# Altium project SolarNode.PrjPCB
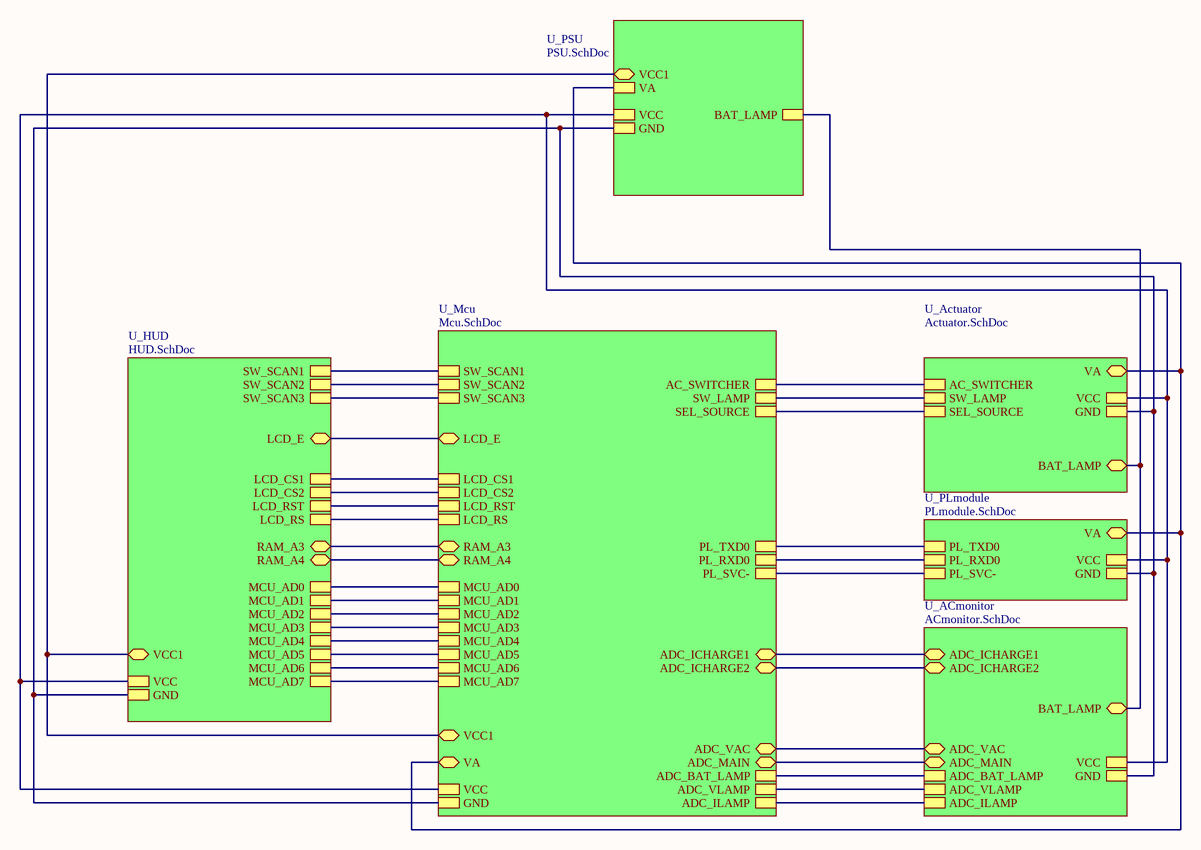
[diagram p0: block.SchDoc]
5 sheets, 176 parts. Net scope: hierarchical (ports join the sheet entries above them; power ports are global).
Board file: SolarNode.PcbDoc
Sheets:
  block.SchDoc
    U_Actuator = Actuator.SchDoc
    U_PSU = PSU.SchDoc
    U_PLmodule = PLmodule.SchDoc
    U_ACmonitor = ACmonitor.SchDoc

## Sheet block.SchDoc
size Letter

### Sub-sheets
U_ACmonitor = ACmonitor.SchDoc: ADC_BAT_LAMP, ADC_VLAMP, ADC_ILAMP, VCC, GND, ADC_VAC, BAT_LAMP, ADC_MAIN, ADC_ICHARGE1, ADC_ICHARGE2
U_Actuator = Actuator.SchDoc: AC_SWITCHER, SW_LAMP, SEL_SOURCE, VCC, GND, BAT_LAMP, VA
U_HUD = HUD.SchDoc (file not in this document): MCU_AD0, MCU_AD1, MCU_AD2, MCU_AD3, MCU_AD4, MCU_AD5, MCU_AD6, MCU_AD7, LCD_CS1, LCD_CS2, LCD_RST, LCD_RS, SW_SCAN1, SW_SCAN2, SW_SCAN3, VCC, GND, LCD_E, RAM_A3, RAM_A4, VCC1
U_Mcu = Mcu.SchDoc (file not in this document): PL_TXD0, PL_RXD0, SW_SCAN1, SW_SCAN2, SW_SCAN3, PL_SVC-, LCD_CS1, LCD_CS2, LCD_RST, LCD_RS, AC_SWITCHER, SW_LAMP, SEL_SOURCE, MCU_AD0, MCU_AD1, MCU_AD2, MCU_AD3, MCU_AD4, MCU_AD5, MCU_AD6, MCU_AD7, VCC, GND, ADC_BAT_LAMP, ADC_VLAMP, ADC_ILAMP, ADC_VAC, LCD_E, ADC_MAIN, VA, ADC_ICHARGE1, ADC_ICHARGE2, RAM_A3, RAM_A4, VCC1
U_PLmodule = PLmodule.SchDoc: PL_SVC-, VCC, GND, PL_TXD0, PL_RXD0, VA
U_PSU = PSU.SchDoc: VCC, GND, BAT_LAMP, VA, VCC1

### Nets
BAT_LAMP: sheet U_Actuator/BAT_LAMP, sheet U_PSU/BAT_LAMP, sheet U_ACmonitor/BAT_LAMP
GND: sheet U_Mcu/GND, sheet U_Actuator/GND, sheet U_PSU/GND, sheet U_HUD/GND, sheet U_PLmodule/GND, sheet U_ACmonitor/GND
VA: sheet U_Mcu/VA, sheet U_Actuator/VA, sheet U_PSU/VA, sheet U_PLmodule/VA
VCC: sheet U_Mcu/VCC, sheet U_Actuator/VCC, sheet U_PSU/VCC, sheet U_HUD/VCC, sheet U_PLmodule/VCC, sheet U_ACmonitor/VCC
VCC1: sheet U_Mcu/VCC1, sheet U_PSU/VCC1, sheet U_HUD/VCC1
AC SWITCHER: sheet U_Mcu/AC_SWITCHER, sheet U_Actuator/AC_SWITCHER
ADC_BAT_LAMP: sheet U_Mcu/ADC_BAT_LAMP, sheet U_ACmonitor/ADC_BAT_LAMP
ADC_ICHARGE1: sheet U_Mcu/ADC_ICHARGE1, sheet U_ACmonitor/ADC_ICHARGE1
ADC_ICHARGE2: sheet U_Mcu/ADC_ICHARGE2, sheet U_ACmonitor/ADC_ICHARGE2
ADC_ILAMP: sheet U_Mcu/ADC_ILAMP, sheet U_ACmonitor/ADC_ILAMP
ADC_MAIN: sheet U_Mcu/ADC_MAIN, sheet U_ACmonitor/ADC_MAIN
ADC_VAC: sheet U_Mcu/ADC_VAC, sheet U_ACmonitor/ADC_VAC
ADC_VLAMP: sheet U_Mcu/ADC_VLAMP, sheet U_ACmonitor/ADC_VLAMP
IO_8: sheet U_Mcu/PL_TXD0, sheet U_PLmodule/PL_TXD0
IO_10: sheet U_Mcu/PL_RXD0, sheet U_PLmodule/PL_RXD0
PL_SVC-: sheet U_Mcu/PL_SVC-, sheet U_PLmodule/PL_SVC-
SEL_SOURCE: sheet U_Mcu/SEL_SOURCE, sheet U_Actuator/SEL_SOURCE
SW_LAMP: sheet U_Mcu/SW_LAMP, sheet U_Actuator/SW_LAMP
(unnamed): sheet U_Mcu/SW_SCAN1, sheet U_HUD/SW_SCAN1
(unnamed): sheet U_Mcu/SW_SCAN2, sheet U_HUD/SW_SCAN2
(unnamed): sheet U_Mcu/SW_SCAN3, sheet U_HUD/SW_SCAN3
(unnamed): sheet U_Mcu/LCD_CS1, sheet U_HUD/LCD_CS1
(unnamed): sheet U_Mcu/LCD_CS2, sheet U_HUD/LCD_CS2
(unnamed): sheet U_Mcu/LCD_RST, sheet U_HUD/LCD_RST
(unnamed): sheet U_Mcu/LCD_RS, sheet U_HUD/LCD_RS
(unnamed): sheet U_Mcu/MCU_AD0, sheet U_HUD/MCU_AD0
(unnamed): sheet U_Mcu/MCU_AD1, sheet U_HUD/MCU_AD1
(unnamed): sheet U_Mcu/MCU_AD2, sheet U_HUD/MCU_AD2
(unnamed): sheet U_Mcu/MCU_AD3, sheet U_HUD/MCU_AD3
(unnamed): sheet U_Mcu/MCU_AD4, sheet U_HUD/MCU_AD4
(unnamed): sheet U_Mcu/MCU_AD5, sheet U_HUD/MCU_AD5
(unnamed): sheet U_Mcu/MCU_AD6, sheet U_HUD/MCU_AD6
(unnamed): sheet U_Mcu/MCU_AD7, sheet U_HUD/MCU_AD7
(unnamed): sheet U_Mcu/LCD_E, sheet U_HUD/LCD_E
(unnamed): sheet U_Mcu/RAM_A3, sheet U_HUD/RAM_A3
(unnamed): sheet U_Mcu/RAM_A4, sheet U_HUD/RAM_A4

## Sheet Actuator.SchDoc
size A3
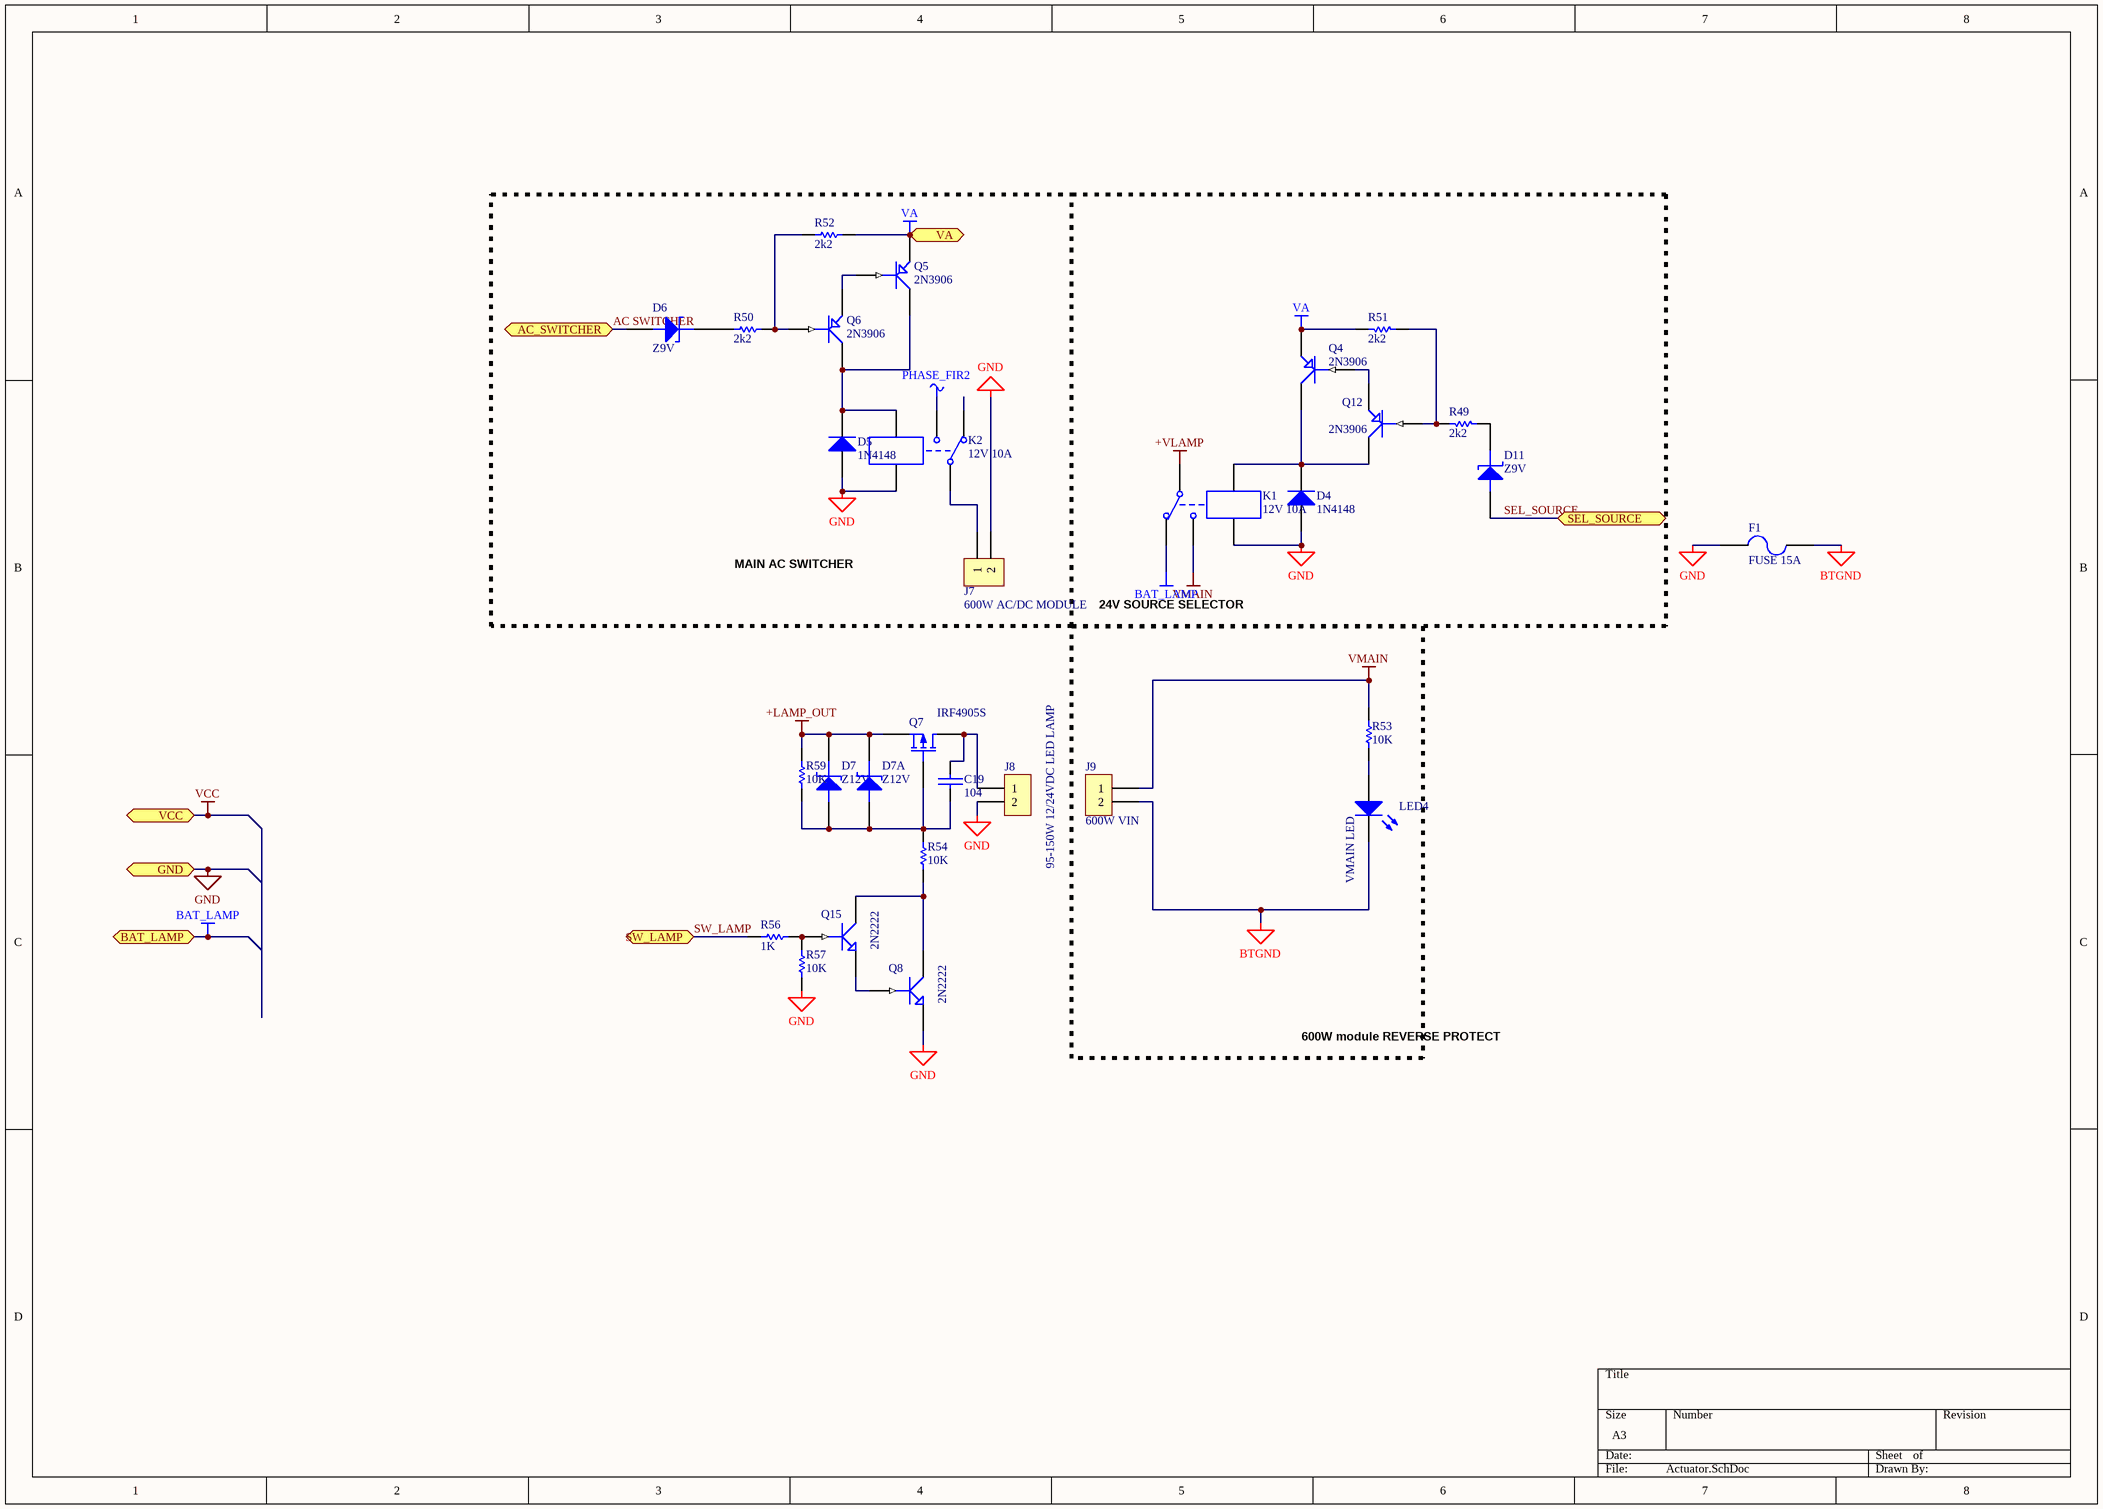
[diagram p1: Actuator.SchDoc]

### Parts
C19  104  [C6-0805_N]
D4  1N4148  [SOD80, LL-34]
D5  1N4148  [SOD80, LL-34]
D6  Z9V  [SOD80, LL-34]
D7  Z12V  [DO-35]
D7A  Z12V  [SOD80, LL-34]
D11  Z9V  [SOD80, LL-34]
F1  FUSE 15A  [FUSE2]
J7  600W AC/DC MODULE  [TERMINAL2]
J8  95-150W 12/24VDC LED LAMP  [TERMINAL2]
J9  600W VIN  [TERMINAL2]
K1  12V 10A  [RELAYVUONG]
K2  12V 10A  [RELAYVUONG]
LED4  VMAIN LED  [led3mm]
Q4  2N3906  [SOT23-3]
Q5  2N3906  [SOT23-3]
Q6  2N3906  [SOT23-3]
Q7  IRF4905S  [D2PAK-3]
Q8  2N2222  [SOT23-3]
Q12  2N3906  [SOT23-3]
Q15  2N2222  [SOT23-3]
R49  2k2  [6-0805_N]
R50  2k2  [6-0805_N]
R51  2k2  [6-0805_N]
R52  2k2  [6-0805_N]
R53  10K  [6-0805_N]
R54  10K  [6-0805_N]
R56  1K  [6-0805_N]
R57  10K  [6-0805_N]
R59  10K  [6-0805_N]

### Blocks framed on the sheet
24V SOURCE SELECTOR: D4 D11 K1 Q4 Q12 R49 R51

### Ports
AC_SWITCHER, BAT_LAMP, GND, SEL_SOURCE, SW_LAMP, VA, VCC

### Nets
+LAMP_OUT: D7.2(K) D7A.2(K) Q7.3(S) R59.2
+VLAMP: K1.1
BAT_LAMP: K1.2 ; port BAT_LAMP
BTGND: F1.2 J9.2 LED4.2(K)
GND: D4.1(A) D5.1(A) F1.1 J7.2 J8.2 K1.5 K2.4 Q8.2(E) R57.1 ; port GND
PHASE_FIR2: K2.3
VA: Q4.2(E) Q5.2(E) R51.2 R52.2 ; port VA
VMAIN: J9.1 K1.3 R53.2
AC SWITCHER: D6.1(A) ; port AC_SWITCHER
SEL_SOURCE: D11.1(A) ; port SEL_SOURCE
SW_LAMP: R56.1 ; port SW_LAMP
NetC19_1: C19.1 J8.1 Q7.2(D)
NetC19_2: C19.2 D7.1(A) D7A.1(A) Q7.1(G) R54.2 R59.1
NetD4_2: D4.2(K) K1.4 Q4.3(C) Q12.3(C)
NetD5_2: D5.2(K) K2.5 Q5.3(C) Q6.3(C)
NetD6_2: D6.2(K) R50.1
NetD11_2: D11.2(K) R49.1
NetJ7_1: J7.1 K2.1
NetLED4_1: LED4.1(A) R53.1
NetQ4_1: Q4.1(B) Q12.2(E)
NetQ5_1: Q5.1(B) Q6.2(E)
NetQ6_1: Q6.1(B) R50.2 R52.1
NetQ8_1: Q8.1(B) Q15.2(E)
NetQ8_3: Q8.3(C) Q15.3(C) R54.1
NetQ12_1: Q12.1(B) R49.2 R51.1
NetQ15_1: Q15.1(B) R56.2 R57.2

Not connected (* = marked no-connect by the designer): K2 2

### Notes on the sheet
- MAIN AC SWITCHER
- 600W module REVERSE PROTECT

### Library data of the parts
C19 = CAP: Capacitor
D4 D5 = Diode 1N4007: 1 Amp General Purpose Rectifier; pin to pad: 1>A 2>K; Published: 8-Jun-2000; LatestRevisionDate: 17-Jul-2002; LatestRevisionNote: Re-released for DXP Platform.; DatasheetDocument: 1998; PackageDocument: Aug-1999; PackageReference: DO-41; Publisher: Altium Limited; Code_JEDEC: DO-204-AL; ComponentLink1Description: Manufacturer Link; ComponentLink1URL: http://www.fairchildsemi.com/; ComponentLink2Description: Datasheet; ComponentLink2URL: http://www.fairchildsemi.com/ds/1N%2F1N4001.pdf
D6 D7A D11 = ZENER2: Zener Diode; pin to pad: 1>A 2>K
D7 = ZENER2: Zener Diode
F1 = FUSE2: Fuse
J7-J9 = CON2: Connector
K1 K2 = Relay-SPDT: G5LA-10A/250VAC / SRC-12VDC-SL-C; Published: 24-Mar-1999; LatestRevisionDate: 17-Jul-2002; LatestRevisionNote: Re-released for DXP Platform.; PackageReference: MODULE5B; Publisher: Altium Limited
LED4 = LED3: Typical BLUE SiC LED; Published: 8-Jun-2000; LatestRevisionDate: 17-Dec-2003; LatestRevisionNote: PCB Footprint replaced.; DatasheetVersion: 16-Apr-2002; PackageVersion: 16-Apr-2002; PackageReference: 3.5X2.8X1.9; Publisher: Altium Limited; PackageDescription: SM LED; 2 C-Bend Leads; Body 3.5 x 2.8 x 1.9 mm, inc leads (LxWxH typ)
Q4-Q6 Q12 = PNP1: PNP Transistor
Q7 = MOSFET-P: HEXFET Power P MOSFET; pin to pad: 2>4; Published: 8-Jun-2000; LatestRevisionDate: 17-Jul-2002; LatestRevisionNote: Re-released for DXP Platform.; PackageVersion: 1995/1996; PackageReference: E3; Publisher: Altium Limited; PackageDescription: TO, Flat Index; 3 In-Line, Axial Leads; Body Dia. 4.6mm; Lead Dia. 0.5 mm (max)
Q8 Q15 = NPN1: NPN Transistor
R49 R50 R53 R57 = Res Semi: Semiconductor Resistor
  R49 R50: Published: 8-Jun-2000; LatestRevisionDate: 17-Jul-2002; LatestRevisionNote: Re-released for DXP Platform.; PackageReference: AXIAL-0.5; Publisher: Altium Limited; Value: 2K2
  R53: Published: *; LatestRevisionDate: *; LatestRevisionNote: *; PackageReference: *; Publisher: *; Value: *
  R57: Published: 8-Jun-2000; LatestRevisionDate: 17-Jul-2002; LatestRevisionNote: Re-released for DXP Platform.; PackageReference: AXIAL-0.5; Publisher: Altium Limited; Value: 10K
R51 R52 = Res Semi: Semiconductor Resistor; Value: 10K; Published: 8-Jun-2000; LatestRevisionDate: 17-Jul-2002; LatestRevisionNote: Re-released for DXP Platform.; PackageReference: AXIAL-0.5; Publisher: Altium Limited
R54 R56 R59 = Res Semi: Semiconductor Resistor; Value: 2K2; Published: 8-Jun-2000; LatestRevisionDate: 17-Jul-2002; LatestRevisionNote: Re-released for DXP Platform.; PackageReference: AXIAL-0.5; Publisher: Altium Limited

## Sheet PSU.SchDoc
size A3
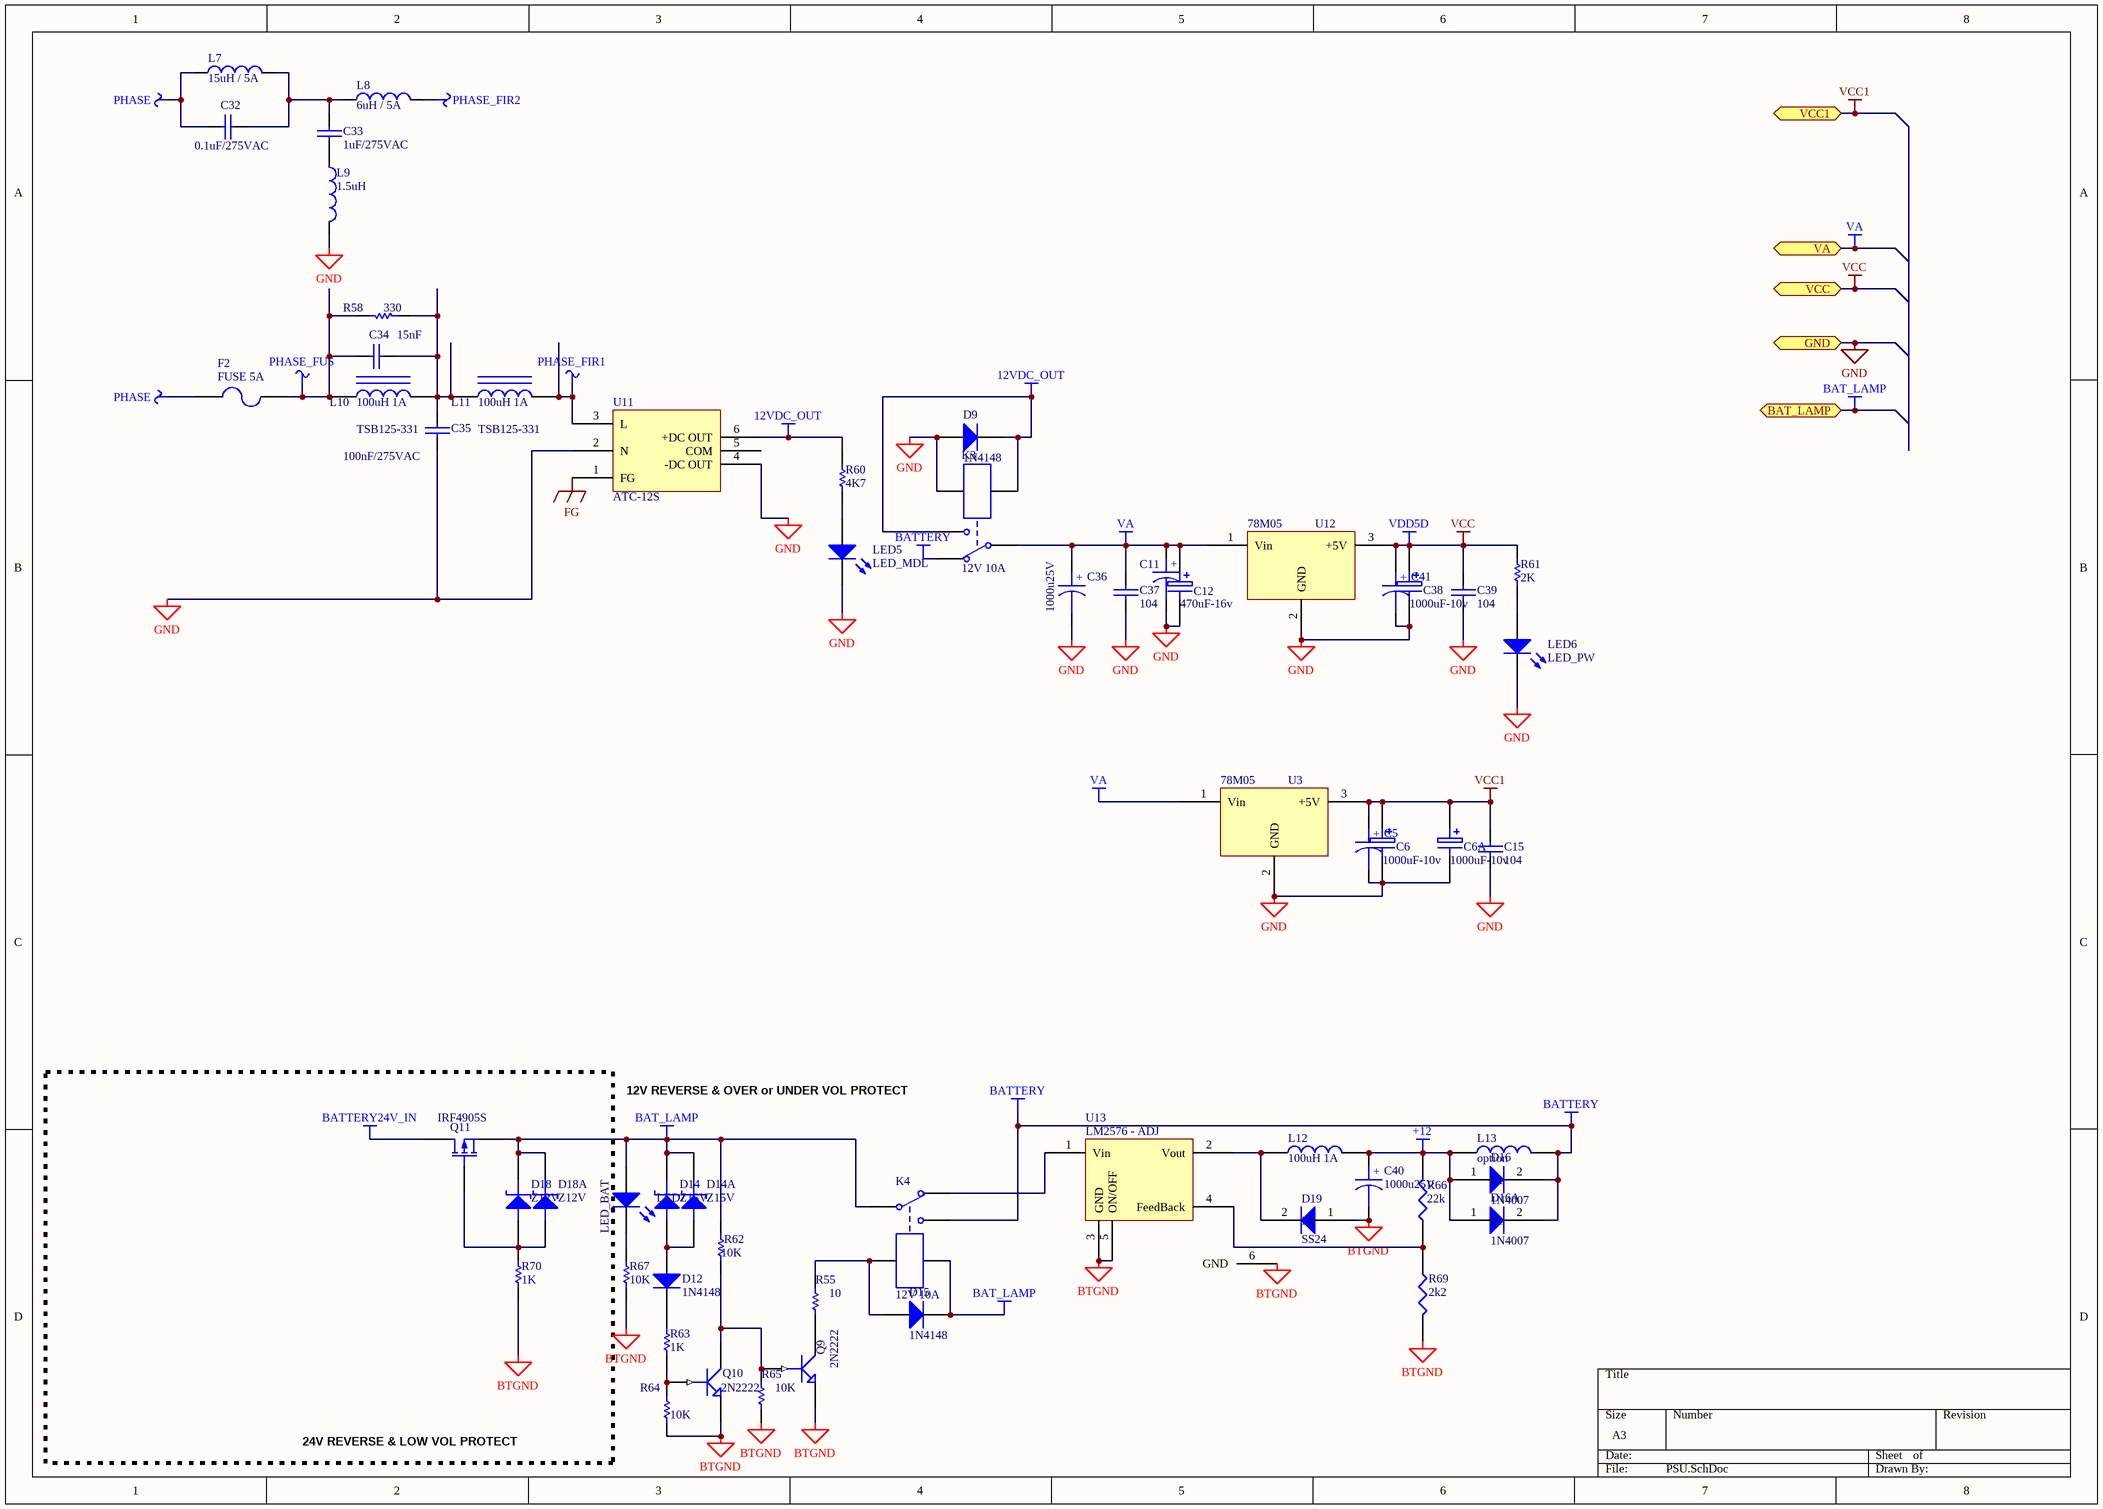
[diagram p2: PSU.SchDoc]

### Parts
C5  1000u25V  [CAP40x20]  (value not drawn)
C6  1000uF-10v  [CAP_ELEC_SIZE_E]
C6A  1000uF-10v  [CAP_ELEC_SIZE_E]
C11  1000u25V  [CAP40x20]  (value not drawn)
C12  470uF-16v  [CAP_ELEC_SIZE_E]
C15  104  [C6-0805_N]
C32  0.1uF/275VAC  [100n400v]
C33  1uF/275VAC  [CAP1.2/0.5]
C34  15nF  [R3216[1206]]
C35  100nF/275VAC  [100n400v]
C36  1000u25V  [CAP40x20]
C37  104  [C6-0805_N]
C38  1000uF-10v  [CAP_ELEC_SIZE_E]
C39  104  [C6-0805_N]
C40  1000u25V  [CAP40x20]
C41  1000u25V  [CAP40x20]  (value not drawn)
D9  1N4148  [SOD80, LL-34]
D12  1N4148  [SOD80, LL-34]
D14  Z15V  [DO-35]
D14A  Z15V  [SOT23-3]
D15  1N4148  [SOD80, LL-34]
D16  1N4007  [DO-214AA]
D16A  1N4007  [DO-214AA]
D18  Z12V  [DO-35]
D18A  Z12V  [SOD80, LL-34]
D19  SS24  [DO-214AA]
F2  FUSE 5A  [FUSE2]
K3  12V 10A  [RELAYVUONG]
K4  12V 10A  [RELAYVUONG]
L7  15uH / 5A  [IND26x8]
L8  6uH / 5A  [IND15X7]
L9  1.5uH  [IND15x7]
L10  100uH 1A  value TSB125-331  [IND1207]
L11  100uH 1A  value TSB125-331  [IND1207]
L12  100uH 1A  [IND1207]
L13  option  [axial-0.3]
LED5  LED_MDL  [LED3mm]
LED6  LED_PW  [LED3mm]
LED7  LED_BAT  [LED3mm]
Q9  2N2222  [SOT23-3]
Q10  2N2222  [SOT23-3]
Q11  IRF4905S  [D2PAK-3]
R55  10  [6-0805_N]
R58  330  [R3216[1206]]
R60  4K7  [6-0805_N]
R61  2K  [6-0805_N]
R62  10K  [6-0805_N]
R63  1K  [6-0805_N]
R64  10K  [6-0805_N]
R65  10K  [6-0805_N]
R66  22k  [6-0805_N]
R67  10K  [6-0805_N]
R69  2k2  [6-0805_N]
R70  1K  [6-0805_N]
U3  78M05  [D2PAK-3]
U11  ATC-12S  [ATC MODULE]
U12  78M05  [D2PAK-3]
U13  LM2576 - ADJ  [TO-263-5]

### Blocks framed on the sheet
24V REVERSE & LOW VOL PROTECT: D18 D18A Q11 R70

### Ports
BAT_LAMP, GND, VA, VCC, VCC1

### Nets
12VDC_OUT: D9.2(K) K3.3 K3.4 R60.2 U11.6(+DC_OUT)
+12: C40.1 D16.1 D16A.1 L12.2 L13.1 R66.2
BAT_LAMP: D14.2(K) D14A.2(K) D15.2(K) D18.2(K) D18A.2(K) K4.1 K4.5 LED7.1(A) Q11.3(S) R62.2 ; port BAT_LAMP
BATTERY: D16.2 D16A.2 K3.2 K4.3 L13.2
BATTERY24V_IN: Q11.2(D)
BTGND: C40.2 D19.1 Q9.2(E) Q10.2(E) R64.1 R65.1 R67.1 R69.2 R70.1 U13.3(GND) U13.5(ON/OFF) U13.6(GND)
FG: U11.1(FG)
GND: C5.2 C6.2 C6A.2 C11.2 C12.2 C15.2 C35.1 C36.2 C37.2 C38.2 C39.2 C41.2 D9.1(A) K3.5 L9.2 LED5.2(K) LED6.2(K) U3.2(GND) U11.2(N) U11.4(-DC_OUT) U12.2(GND) ; port GND
PHASE: C32.2 F2.1 L7.1
PHASE_FIR1: L11.2 U11.3(L)
PHASE_FIR2: L8.2
PHASE_FUS: C34.1 F2.2 L10.1 R58.2
VA: C11.1 C12.1 C36.1 C37.1 K3.1 U3.1(Vin) U12.1(Vin) ; port VA
VCC: C38.1 C39.1 C41.1 R61.2 U12.3(+5V) ; port VCC  [also labelled VDD5D]
VCC1: C5.1 C6.1 C6A.1 C15.1 U3.3(+5V) ; port VCC1
NetC32_1: C32.1 C33.1 L7.2 L8.1
NetC33_2: C33.2 L9.1
NetC34_2: C34.2 C35.2 L10.2 L11.1 R58.1
NetD12_1: D12.1(A) D14.1(A) D14A.1(A)
NetD12_2: D12.2(K) R63.2
NetD15_1: D15.1(A) K4.4 R55.2
NetD18_1: D18.1(A) D18A.1(A) Q11.1(G) R70.2
NetD19_2: D19.2 L12.1 U13.2(Vout)
NetK4_2: K4.2 U13.1(Vin)
NetLED5_1: LED5.1(A) R60.1
NetLED6_1: LED6.1(A) R61.1
NetLED7_2: LED7.2(K) R67.2
NetQ9_1: Q9.1(B) Q10.3(C) R62.1 R65.2
NetQ9_3: Q9.3(C) R55.1
NetQ10_1: Q10.1(B) R63.1 R64.2
NetR66_1: R66.1 R69.1 U13.4(FeedBack)

Not connected (* = marked no-connect by the designer): U11 5(COM)

### Notes on the sheet
- 12V REVERSE & OVER or UNDER VOL PROTECT
- (in symbol CAPACITOR POL) +

### Library data of the parts
C5 C11 C36 C40 C41 = CAPACITOR POL: Capacitor
C6 C6A C12 C38 = ELECTRO1: Electrolytic Capacitor
C15 C34 C37 C39 = CAP: Capacitor
C32 = CAP: 0.1uF/275VAC X2
C33 = CAP: 1uF/275VAC X2
C35 = CAP: 100nF/275VAC X2
D9 D12 D15 = Diode 1N4007: 1 Amp General Purpose Rectifier; pin to pad: 1>A 2>K; Published: 8-Jun-2000; LatestRevisionDate: 17-Jul-2002; LatestRevisionNote: Re-released for DXP Platform.; DatasheetDocument: 1998; PackageDocument: Aug-1999; PackageReference: DO-41; Publisher: Altium Limited; Code_JEDEC: DO-204-AL; ComponentLink1Description: Manufacturer Link; ComponentLink1URL: http://www.fairchildsemi.com/; ComponentLink2Description: Datasheet; ComponentLink2URL: http://www.fairchildsemi.com/ds/1N%2F1N4001.pdf
D14 D18 = ZENER2: Zener Diode
D14A = ZENER2: Zener Diode; pin to pad: 2>3
D16 D16A D19 = DIODE: Hoangphat; pin to pad: 1>A 2>K
D18A = ZENER2: Zener Diode; pin to pad: 1>A 2>K
F2 = FUSE2: Fuse
K3 K4 = Relay-SPDT: G5LA-10A/250VAC / SRC-12VDC-SL-C; Published: 24-Mar-1999; LatestRevisionDate: 17-Jul-2002; LatestRevisionNote: Re-released for DXP Platform.; PackageReference: MODULE5B; Publisher: Altium Limited
L7-L9 = Inductor: Toirodal Inductor; Code_IEC: 1005; Published: 8-Jun-2000; LatestRevisionDate: 29-May-2009; LatestRevisionNote: IPC-7351 Footprint Added.; PackageReference: 0402-A; Publisher: Altium Limited; PackageDescription: Chip Inductor; Code_JEITA: 0402
  L7: Value: 15uH / 5A
  L8: Value: 6uH / 5A
  L9: Value: 1.5uH
L10 L11 = INDUCTOR IRON: 100uH 1A SMD HP
L12 L13 = INDUCTOR
LED5-LED7 = LED3: Typical BLUE SiC LED; Published: 8-Jun-2000; LatestRevisionDate: 17-Dec-2003; LatestRevisionNote: PCB Footprint replaced.; DatasheetVersion: 16-Apr-2002; PackageVersion: 16-Apr-2002; PackageReference: 3.5X2.8X1.9; Publisher: Altium Limited; PackageDescription: SM LED; 2 C-Bend Leads; Body 3.5 x 2.8 x 1.9 mm, inc leads (LxWxH typ)
Q9 Q10 = NPN1: NPN Transistor
Q11 = MOSFET-P: HEXFET Power P MOSFET; pin to pad: 2>4; Published: 8-Jun-2000; LatestRevisionDate: 17-Jul-2002; LatestRevisionNote: Re-released for DXP Platform.; PackageVersion: 1995/1996; PackageReference: E3; Publisher: Altium Limited; PackageDescription: TO, Flat Index; 3 In-Line, Axial Leads; Body Dia. 4.6mm; Lead Dia. 0.5 mm (max)
R55 R60-R65 R67 R70 = Res Semi: Semiconductor Resistor; Published: *; LatestRevisionDate: *; LatestRevisionNote: *; PackageReference: *; Publisher: *; Value: *
R58 = Res Semi: Semiconductor Resistor; Value: 2K2; Published: 8-Jun-2000; LatestRevisionDate: 17-Jul-2002; LatestRevisionNote: Re-released for DXP Platform.; PackageReference: AXIAL-0.5; Publisher: Altium Limited
R66 R69 = RES1
U3 U12 = MC7805T: pin to pad: 2>4
U11 = Component_1
U13 = LM2576

## Sheet PLmodule.SchDoc
size A4
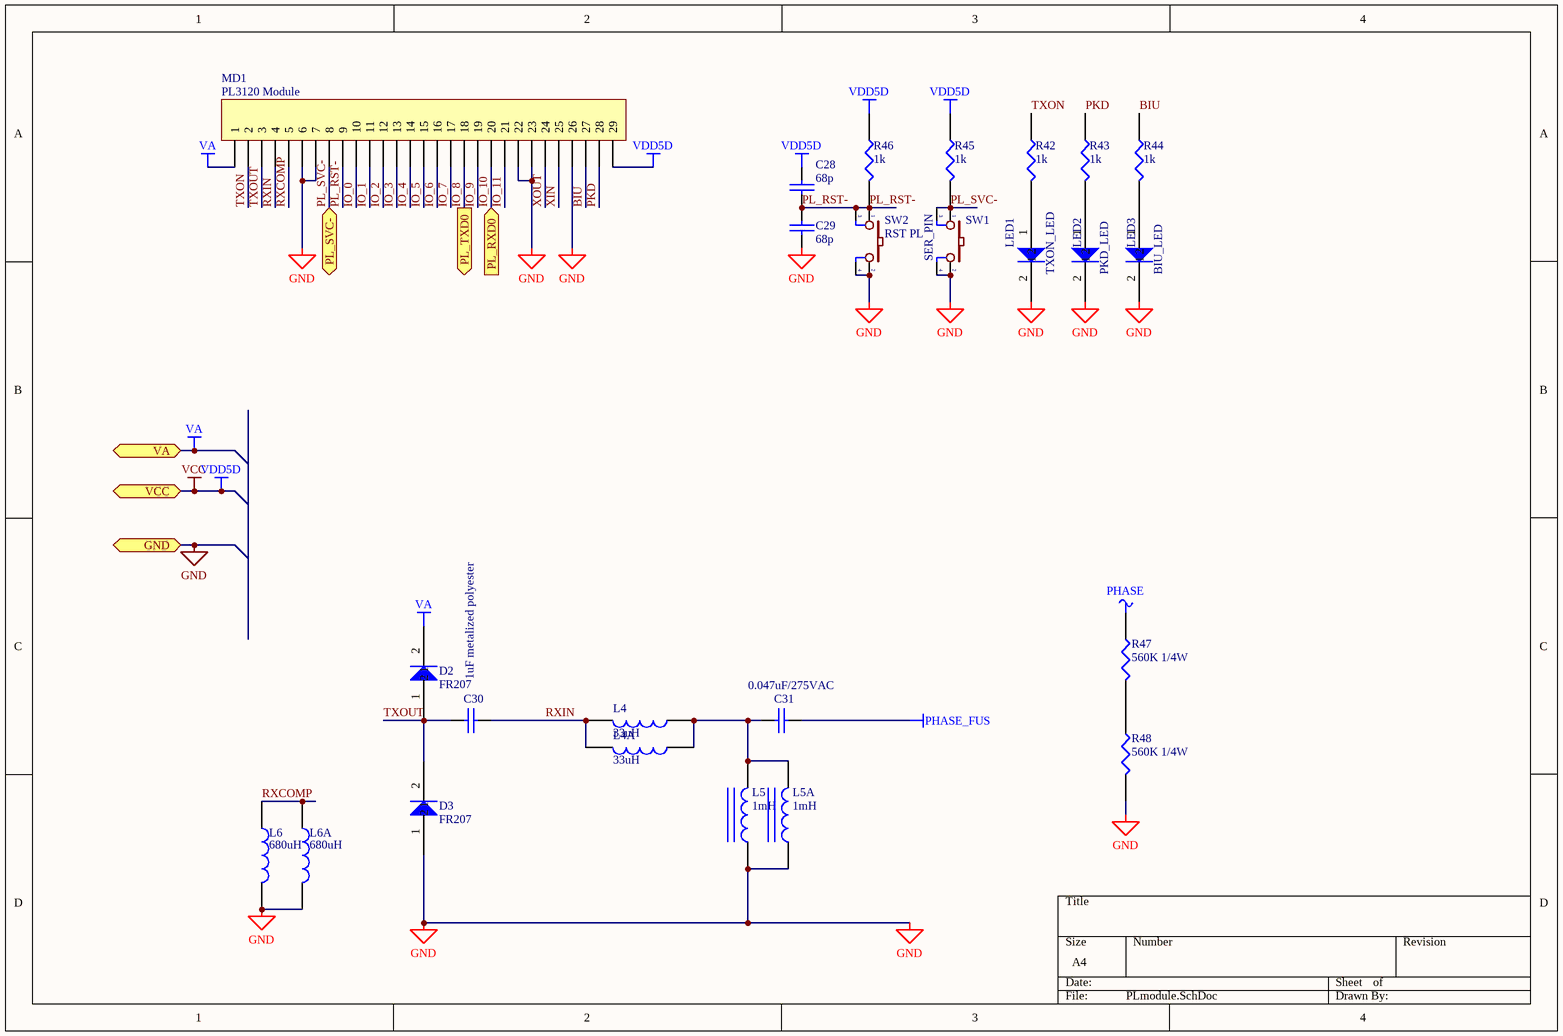
[diagram p3: PLmodule.SchDoc]

### Parts
C28  68p  [C6-0805_N]
C29  68p  [C6-0805_N]
C30  1uF metalized polyester  [CSIP3]
C31  0.047uF/275VAC  [100n400v]
D2  FR207  [DO-214AA]
D3  FR207  [DO-214AA]
L4  33uH  [6D28]
L4A  33uH  [Axial-0.4]
L5  1mH  [6-0805_N]
L5A  1mH  [AXIAL-0.4]
L6  680uH  [6-0805_N]
L6A  680uH  [AXIAL-0.4]
LED1  TXON_LED  [led3mm]
LED2  PKD_LED  [led3mm]
LED3  BIU_LED  [led3mm]
MD1  PL3120 Module  [ECHELONMODULE]
R42  1k  [6-0805_N]
R43  1k  [6-0805_N]
R44  1k  [6-0805_N]
R45  1k  [6-0805_N]
R46  1k  [6-0805_N]
R47  560K 1/4W  [R3216[1206]]
R48  560K 1/4W  [R3216[1206]]
SW1  SER_PIN  [SW-4P-S]
SW2  RST PL  [SW-4P-S]

### Ports
GND, PL_RXD0, PL_SVC-, PL_TXD0, VA, VCC

### Nets
GND: C29.2 D3.1 L5.2 L5A.2 L6.2 L6A.2 LED1.2 LED2.2 LED3.2 MD1.6 MD1.7 MD1.22 MD1.23 MD1.26 R48.1 SW1.2 SW1.4 SW2.2 SW2.4 ; port GND
PHASE: R47.2
PHASE_FUS: C31.1
VA: D2.2 MD1.1 ; port VA
VCC: C28.2 MD1.29 R45.1 R46.1 ; port VCC  [also labelled VDD5D]
BIU: MD1.27 R44.1
IO_0: MD1.10
IO_1: MD1.11
IO_2: MD1.12
IO_3: MD1.13
IO_4: MD1.14
IO_5: MD1.15
IO_6: MD1.16
IO_7: MD1.17
IO_8: MD1.18 ; port PL_TXD0
IO_9: MD1.19
IO_10: MD1.20 ; port PL_RXD0
IO_11: MD1.21
PKD: MD1.28 R43.1
PL_RST-: C28.1 C29.1 MD1.9 R46.2 SW2.1 SW2.3
PL_SVC-: MD1.8 R45.2 SW1.1 SW1.3 ; port PL_SVC-
RXCOMP: L6.1 L6A.1 MD1.5
RXIN: C30.2 L4.1 L4A.1 MD1.4
TXON: MD1.2 R42.1
TXOUT: C30.1 D2.1 D3.2 MD1.3
XIN: MD1.25
XOUT: MD1.24
NetC31_2: C31.2 L4.2 L4A.2 L5.1 L5A.1
NetLED1_1: LED1.1 R42.2
NetLED2_1: LED2.1 R43.2
NetLED3_1: LED3.1 R44.2
NetR47_1: R47.1 R48.2

### Library data of the parts
C28-C30 = CAP: Capacitor
C31 = CAP: X2 0.047uF/275VAC
D2 D3 = DIODE: pin to pad: 1>A 2>K
L4 = INDUCTOR: 0805 inductor
L4A = INDUCTOR: Axial inductor
L5 L5A = INDUCTOR IRON
L6 L6A = INDUCTOR
LED1-LED3 = DIODE
MD1 = CON29: Connector
R42-R48 = RES1
SW1 SW2 = SW4-1: Switch button 4 pin; pin to pad: 3>4 4>3; Value: SW chip 4 pin

## Sheet ACmonitor.SchDoc
size A3
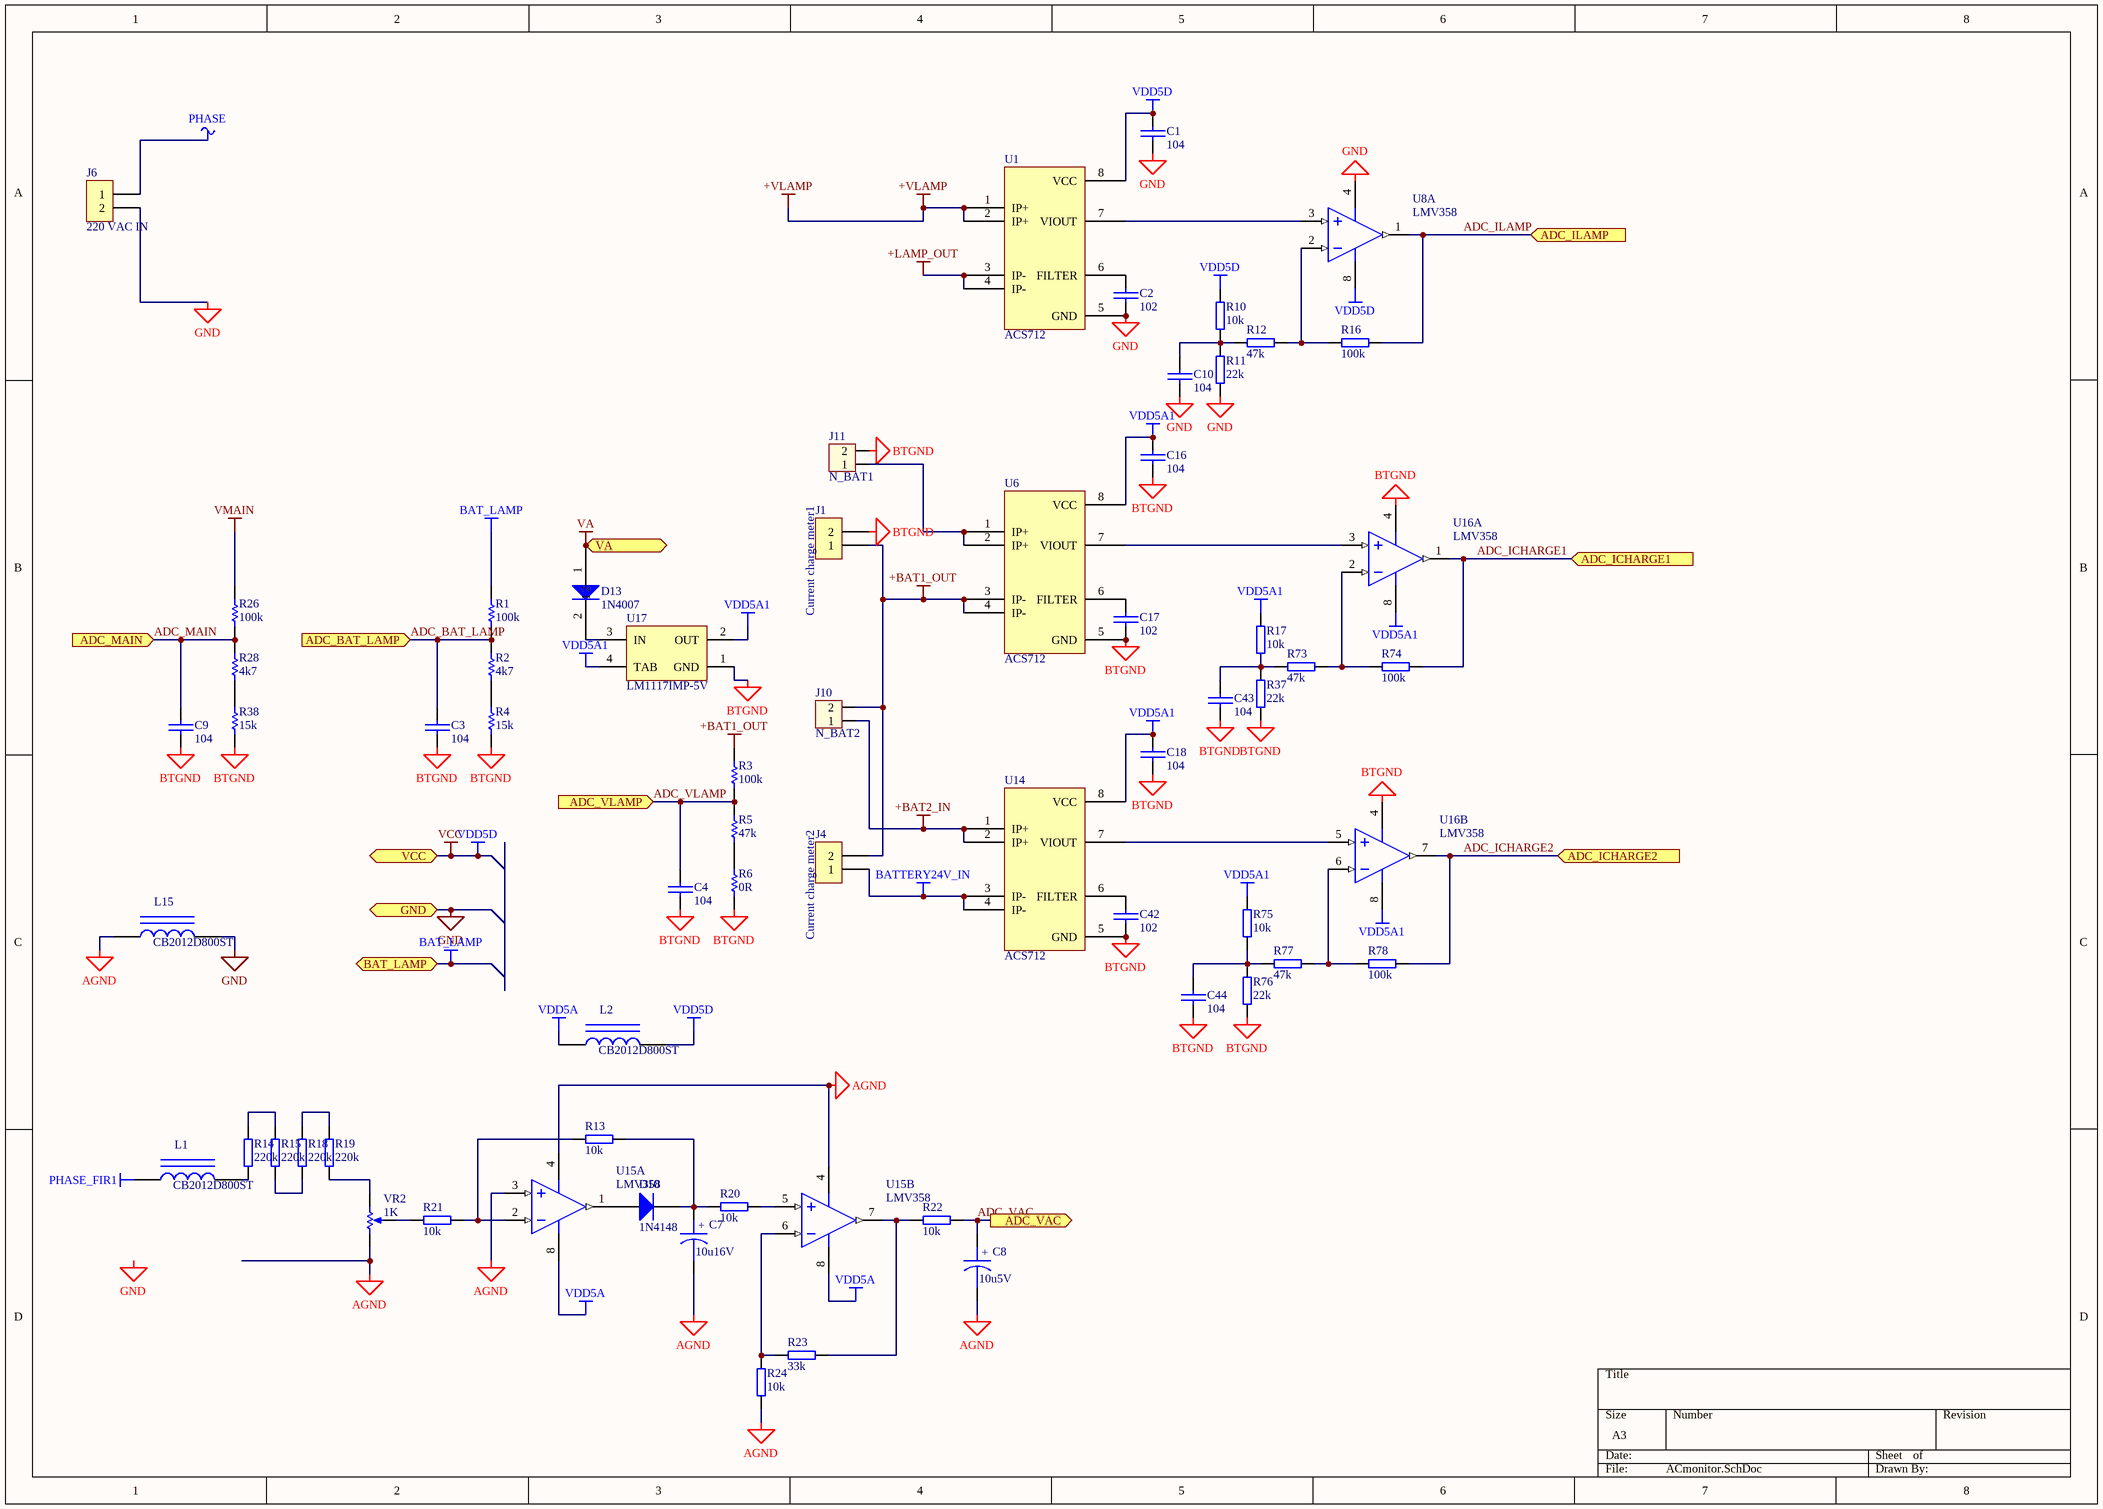
[diagram p4: ACmonitor.SchDoc]

### Parts
C1  104  [C6-0805_N]
C2  102  [C6-0805_N]
C3  104  [C6-0805_N]
C4  104  [C6-0805_N]
C7  10u16V  [CAPMP7343X310N]
C8  10u5V  [CAPMP3528X210N]
C9  104  [C6-0805_N]
C10  104  [C6-0805_N]
C16  104  [C6-0805_N]
C17  102  [C6-0805_N]
C18  104  [C6-0805_N]
C42  102  [C6-0805_N]
C43  104  [C6-0805_N]
C44  104  [C6-0805_N]
D10  1N4148  [SOD80, LL-34]
D13  1N4007  [DO-214AA]
J1  Current charge meter1  [TERMINAL2]
J4  Current charge meter2  [TERMINAL2]
J6  220 VAC IN  [TERMINAL2]
J10  N_BAT2  [TERMINAL2]
J11  N_BAT1  [TERMINAL2]
L1  CB2012D800ST  [R6-0805_N]
L2  CB2012D800ST  [R6-0805_N]
L15  CB2012D800ST  [R6-0805_N]
R1  100k  [6-0805_N]
R2  4k7  [6-0805_N]
R3  100k  [6-0805_N]
R4  15k  [6-0805_N]
R5  47k  [6-0805_N]
R6  0R  [6-0805_N]
R10  10k  [6-0805_N]
R11  22k  [6-0805_N]
R12  47k  [6-0805_N]
R13  10k  [6-0805_N]
R14  220k  [R3216[1206]]
R15  220k  [R3216[1206]]
R16  100k  [6-0805_N]
R17  10k  [6-0805_N]
R18  220k  [R3216[1206]]
R19  220k  [R3216[1206]]
R20  10k  [6-0805_N]
R21  10k  [6-0805_N]
R22  10k  [6-0805_N]
R23  33k  [6-0805_N]
R24  10k  [6-0805_N]
R26  100k  [6-0805_N]
R28  4k7  [6-0805_N]
R37  22k  [6-0805_N]
R38  15k  [6-0805_N]
R73  47k  [6-0805_N]
R74  100k  [6-0805_N]
R75  10k  [6-0805_N]
R76  22k  [6-0805_N]
R77  47k  [6-0805_N]
R78  100k  [6-0805_N]
U1  ACS712  [M08A_N]
U6  ACS712  [M08A_N]
U8  LMV358  [M08A_N]  (part A of 2)
U14  ACS712  [M08A_N]
U15  LMV358  [M08A_N]  (parts A,B of 2)
U16  LMV358  [M08A_N]  (parts A,B of 2)
U17  LM1117IMP-5V  [MP04A_N]
VR2  1K  [BTXANH]

### Ports
ADC_BAT_LAMP, ADC_ICHARGE1, ADC_ICHARGE2, ADC_ILAMP, ADC_MAIN, ADC_VAC, ADC_VLAMP, BAT_LAMP, GND, VA, VCC

### Nets
+BAT1_OUT: J1.1 J4.2 J10.2 R3.1 U6.3(IP-) U6.4(IP-)
+BAT2_IN: J10.1 U14.1(IP+) U14.2(IP+)
+LAMP_OUT: U1.3(IP-) U1.4(IP-)
+VLAMP: U1.1(IP+) U1.2(IP+)
AGND: C7.2 C8.2 L15.1 R24.2 U15.3(INA+) U15.4(GND) VR2.1(TOP)
BAT_LAMP: R1.1 ; port BAT_LAMP
BATTERY24V_IN: J4.1 U14.3(IP-) U14.4(IP-)
BTGND: C3.2 C4.2 C9.2 C16.2 C17.2 C18.2 C42.2 C43.2 C44.2 J1.2 J11.2 R4.2 R6.2 R37.2 R38.2 R76.2 U6.5(GND) U14.5(GND) U16.4(GND) U17.1(GND)
GND: C1.2 C2.2 C10.2 J6.2 L15.2 R11.2 U1.5(GND) U8.4(GND) ; port GND
PHASE: J6.1
PHASE_FIR1: L1.1
VA: D13.1 ; port VA
VCC: C1.1 L2.2 R10.2 U1.8(VCC) U8.8(V+) ; port VCC  [also labelled VDD5D]
VDD5A: L2.1 U15.8(V+)
VDD5A1: C16.1 C18.1 R17.2 R75.1 U6.8(VCC) U14.8(VCC) U16.8(V+) U17.2(OUT) U17.4(TAB)
VMAIN: R26.1
ADC_BAT_LAMP: C3.1 R1.2 R2.1 ; port ADC_BAT_LAMP
ADC_ICHARGE1: R74.2 U16.1(OUTA) ; port ADC_ICHARGE1
ADC_ICHARGE2: R78.2 U16.7(OUTB) ; port ADC_ICHARGE2
ADC_ILAMP: R16.2 U8.1(OUTA) ; port ADC_ILAMP
ADC_MAIN: C9.1 R26.2 R28.1 ; port ADC_MAIN
ADC_VAC: C8.1 R22.1 ; port ADC_VAC
ADC_VLAMP: C4.1 R3.2 R5.1 ; port ADC_VLAMP
NetC2_1: C2.1 U1.6(FILTER)
NetC7_1: C7.1 D10.2(K) R13.1 R20.2
NetC10_1: C10.1 R10.1 R11.1 R12.2
NetC17_1: C17.1 U6.6(FILTER)
NetC42_1: C42.1 U14.6(FILTER)
NetC43_1: C43.1 R17.1 R37.1 R73.2
NetC44_1: C44.1 R75.2 R76.1 R77.2
NetD10_1: D10.1(A) U15.1(OUTA)
NetD13_2: D13.2 U17.3(IN)
NetJ11_1: J11.1 U6.1(IP+) U6.2(IP+)
NetL1_2: L1.2 R14.2
NetR2_2: R2.2 R4.1
NetR5_2: R5.2 R6.1
NetR12_1: R12.1 R16.1 U8.2(INA-)
NetR13_2: R13.2 R21.1 U15.2(INA-)
NetR14_1: R14.1 R15.1
NetR15_2: R15.2 R18.2
NetR18_1: R18.1 R19.1
NetR19_2: R19.2 VR2.3(BOT)
NetR20_1: R20.1 U15.5(INB+)
NetR21_2: R21.2 VR2.2(TAP)
NetR22_2: R22.2 R23.1 U15.7(OUTB)
NetR23_2: R23.2 R24.1 U15.6(INB-)
NetR28_2: R28.2 R38.1
NetR73_1: R73.1 R74.1 U16.2(INA-)
NetR77_1: R77.1 R78.1 U16.6(INB-)
NetU1_7: U1.7(VIOUT) U8.3(INA+)
NetU6_7: U6.7(VIOUT) U16.3(INA+)
NetU14_7: U14.7(VIOUT) U16.5(INB+)

### Notes on the sheet
- Labels drawn without touching a wire or pin: GND
- (in symbol CAPACITOR POL) +

### Library data of the parts
C1-C4 C9 C10 C16-C18 C42-C44 = CAP: Capacitor
C7 C8 = CAPACITOR POL: Capacitor
D10 = Diode 1N4007: 1 Amp General Purpose Rectifier; pin to pad: 1>A 2>K; Published: 8-Jun-2000; LatestRevisionDate: 17-Jul-2002; LatestRevisionNote: Re-released for DXP Platform.; DatasheetDocument: 1998; PackageDocument: Aug-1999; PackageReference: DO-41; Publisher: Altium Limited; Code_JEDEC: DO-204-AL; ComponentLink1Description: Manufacturer Link; ComponentLink1URL: http://www.fairchildsemi.com/; ComponentLink2Description: Datasheet; ComponentLink2URL: http://www.fairchildsemi.com/ds/1N%2F1N4001.pdf
D13 = DIODE: pin to pad: 1>A 2>K
J1 J4 J6 = CON2: Connector
J10 J11 = Con2: Connector 2; Value: Connector 2
L1 L2 L15 = INDUCTOR IRON: 80 Ohm SMD-0805 Chip Ferrite Bead
R1-R6 R26 R28 R38 = Res Semi: Semiconductor Resistor; Published: *; LatestRevisionDate: *; LatestRevisionNote: *; PackageReference: *; Publisher: *; Value: *
R10-R24 R37 R73-R78 = RES2
U8 U15 U16 = LM358AM: Low Power Dual Operational Amplifier, 8-pin Narrow SOIC; Manufacturer: National Semiconductor; PackageTopMarking: NSZXTT*LM*358AM; PowerWise: N; CompType: Amplifiers; Published: 4-Dec-2008; LatestRevisionDate: 13-Jan-2009; LatestRevisionNote: Sim Model Added.; DatasheetVersion: Oct-2005; PackageVersion: revM, May-2009; PackageReference: M08A; Publisher: Altium Limited; PackageDescription: SOIC Narrow, 4.9 x 3.9 x 1.45mm, 8 Lead, 1.27mm Pitch; Supplier 1: Farnell; Supplier Part Number 1: 9486801; PartNumber: LM358AM; RoHS: N; PinCount: 8; Code_JEDEC: MS-012-AA; Code_IPC: SOIC127P600-8; ComponentLink1Description: LM358 Datasheet; ComponentLink1URL: http://www.national.com/ds/LM/LM358.pdf; ComponentLink2Description: LM358 Web Page; ComponentLink2URL: http://www.national.com/pf/LM/LM358.html; ComponentLink3Description: M08A Package Page; ComponentLink3URL: http://www.national.com/packaging/folders/m08a.html
U17 = LM1117IMP-3.3: 800mA Low-Dropout Linear Regulator, 4-pin SOT-223; Manufacturer: National Semiconductor; PackageTopMarking: XYTT*N05B; PowerWise: N; CompType: LDO IC; Published: 4-Dec-2008; DatasheetVersion: Apr-2006; PackageVersion: revB, Apr-2003; PackageReference: MP04A; Publisher: Altium Limited; PackageDescription: Molded SOT-223, 6.50 x 3.56 x 1.6mm Body, 4 Lead, 2.3mm Pitch; Supplier 1: Farnell; Supplier Part Number 1: 7614123; PartNumber: LM1117IMP-3.3; RoHS: N; PinCount: 4; Code_JEDEC: TO-261-AA; Code_IPC: SOT223-4; ComponentLink1Description: LM1117 Datasheet; ComponentLink1URL: http://www.national.com/ds/LM/LM1117.pdf; ComponentLink2Description: LM1117 Web Page; ComponentLink2URL: http://www.national.com/pf/LM/LM1117.html; ComponentLink3Description: MP04A Package Page; ComponentLink3URL: http://www.national.com/packaging/folders/mp04a.html
VR2 = RPot: Potentiometer; Published: *; LatestRevisionDate: *; LatestRevisionNote: *; PackageReference: *; Publisher: *; Sim Note: *; Set Position: *; Value: *

## Nets that join several sheets
+LAMP_OUT: Actuator (D7.2 D7A.2 Q7.3 R59.2), ACmonitor (U1.3 U1.4)
+VLAMP: Actuator (K1.1), ACmonitor (U1.1 U1.2)
BAT_LAMP: Actuator (K1.2), PSU (10 pins), ACmonitor (R1.1)
BATTERY24V_IN: PSU (Q11.2), ACmonitor (J4.1 U14.3 U14.4)
BTGND: Actuator (F1.2 J9.2 LED4.2), PSU (12 pins), ACmonitor (20 pins)
GND: Actuator (9 pins), PSU (21 pins), PLmodule (19 pins), ACmonitor (8 pins)
PHASE: PSU (C32.2 F2.1 L7.1), PLmodule (R47.2), ACmonitor (J6.1)
PHASE_FIR1: PSU (L11.2 U11.3), ACmonitor (L1.1)
PHASE_FIR2: Actuator (K2.3), PSU (L8.2)
PHASE_FUS: PSU (C34.1 F2.2 L10.1 R58.2), PLmodule (C31.1)
VA: Actuator (Q4.2 Q5.2 R51.2 R52.2), PSU (7 pins), PLmodule (D2.2 MD1.1), ACmonitor (D13.1)
VCC: PSU (5 pins), PLmodule (C28.2 MD1.29 R45.1 R46.1), ACmonitor (5 pins)
VMAIN: Actuator (J9.1 K1.3 R53.2), ACmonitor (R26.1)